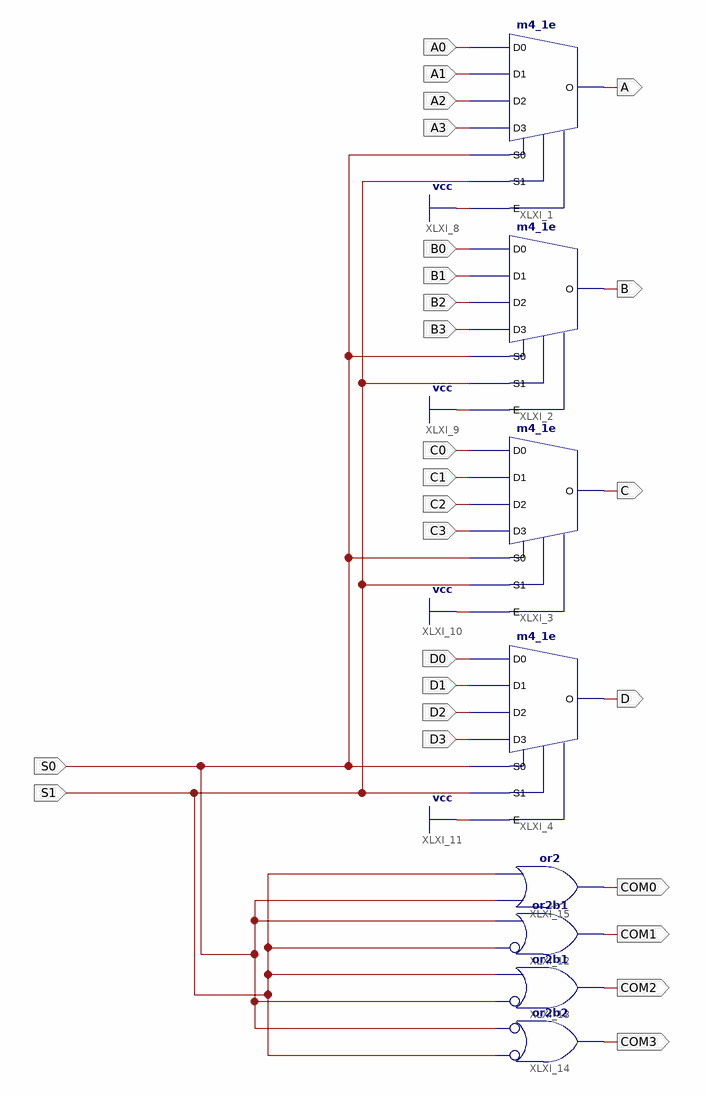
[diagram p0: schematic sheet 1]
// Xilinx ISE schematic multiplexer4_1.sch (spartan6) as structural Verilog: 8 symbols, 26 ports
module multiplexer4_1 (
  input  S1,
  input  S0,
  input  A0,
  input  A1,
  input  A2,
  input  A3,
  input  B0,
  input  B1,
  input  B2,
  input  B3,
  input  C0,
  input  C1,
  input  C2,
  input  C3,
  input  D0,
  input  D1,
  input  D2,
  input  D3,
  output COM0,
  output COM1,
  output COM2,
  output COM3,
  output A,
  output B,
  output C,
  output D
);

  m4_1e XLXI_1 (.D0(A0), .D1(A1), .D2(A2), .D3(A3), .E(1'b1), .S0(S0), .S1(S1), .O(A));
  m4_1e XLXI_2 (.D0(B0), .D1(B1), .D2(B2), .D3(B3), .E(1'b1), .S0(S0), .S1(S1), .O(B));
  m4_1e XLXI_3 (.D0(C0), .D1(C1), .D2(C2), .D3(C3), .E(1'b1), .S0(S0), .S1(S1), .O(C));
  m4_1e XLXI_4 (.D0(D0), .D1(D1), .D2(D2), .D3(D3), .E(1'b1), .S0(S0), .S1(S1), .O(D));
  or XLXI_12 (COM1, ~S1, S0);  // or2b1
  or XLXI_13 (COM2, ~S0, S1);  // or2b1
  or XLXI_14 (COM3, ~S1, ~S0);  // or2b2
  or XLXI_15 (COM0, S0, S1);
endmodule
